# EAGLE design BackPanelBoard (EAGLE 8.3.1)
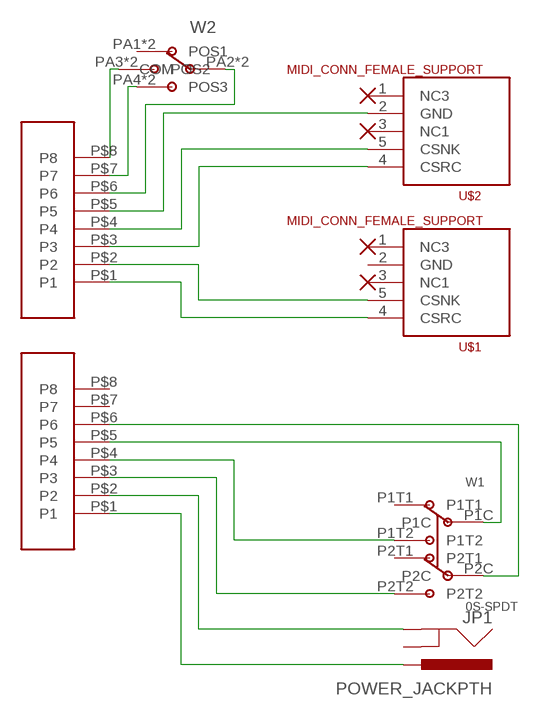
[diagram p0: schematic, sheet 1]

## Parts
JP1  POWER_JACKPTH  [POWER_JACK_PTH]
U$1  MIDI_CONN_FEMALE_SUPPORT  [DIN_5_FEMALE_SUPPORT]
U$2  MIDI_CONN_FEMALE_SUPPORT  [DIN_5_FEMALE_SUPPORT]
U$3  JST_PH8THROUGH_HOLE  [JST_PH8]
U$4  JST_PH8THROUGH_HOLE  [JST_PH8]
W1  0S-SPDT  [0S-SPDT]
W2  0S-SP3T  [0S-SP3T]

## Nets
N$1: U$1.4(CSRC) U$3.P$1(P1)
N$2: U$1.5(CSNK) U$3.P$2(P2)
N$3: U$2.4(CSRC) U$3.P$3(P3)
N$4: U$2.5(CSNK) U$3.P$4(P4)
N$5: U$2.2(GND) U$3.P$5(P5)
N$6: JP1.PWR U$4.P$1(P1)
N$7: JP1.GND U$4.P$2(P2)
N$8: U$4.P$3(P3) W1.P2T2
N$9: U$4.P$4(P4) W1.P1T2
N$10: U$4.P$5(P5) W1.P1C
N$11: U$4.P$6(P6) W1.P2C
N$12: U$3.P$6(P6) W2.PA2(COM) W2.PA6(COM)
N$13: U$3.P$7(P7) W2.PA4(POS3) W2.PA8(POS3)
N$14: U$3.P$8(P8) W2.PA3(POS2) W2.PA7(POS2)
Unconnected: JP1.GNDBREAK U$1.1(NC3) U$1.2(GND) U$1.3(NC1) U$2.1(NC3) U$2.3(NC1) U$4.P$7(P7) U$4.P$8(P8) W1.P1T1 W1.P2T1 W2.PA1(POS1) W2.PA5(POS1)

## Library data of the parts
JP1 = JunoCTRL 1.3:POWER_JACK: Power Jack This is the standard 5.5mm barrel jack for power. The PTH is the most common, proven, reliable, footprint. The Slot footprint only works if the mill layer is transmitted to the PCB fab house so be warned. Mating wall wart : TOL-00298 (and others); PROD_ID: CONN-08197
U$1 U$2 = JunoCTRL 1.3:MIDI_CONN_FEMALE_SUPPORT: MIDI connector with strain relief (DIN-5 female)
U$3 U$4 = JSTCustom:JST_PH8
W1 = JunoCTRL 1.3:0S-SPDT: E-Switch EG 2208A DPDT Switch
W2 = JunoCTRL 1.3:0S-SP3T: E-Switch EG2310 DP3T

## Board
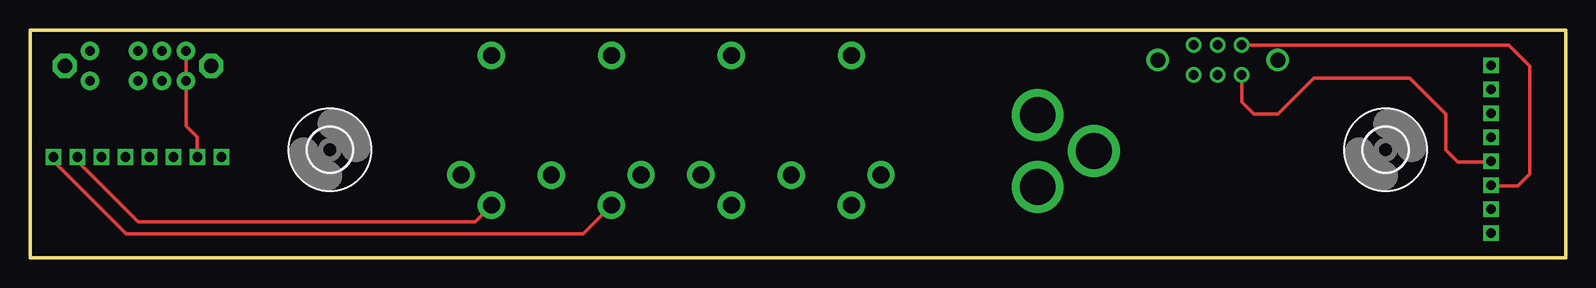
[diagram p1: board, top side]
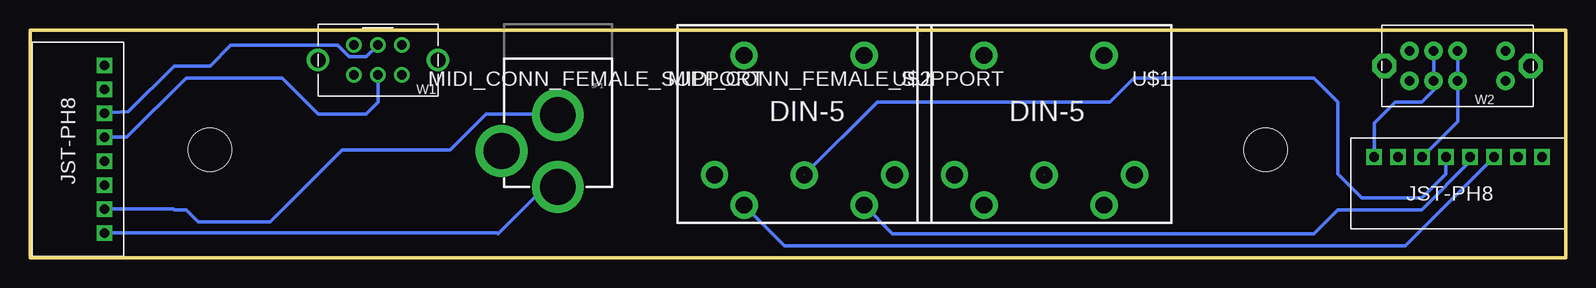
[diagram p2: board, bottom side, seen from below]

Size 128 x 19 mm. Coordinates in mm from the lower left corner, seen from the top.
Outline: 0,0 128,0 128,19 0,19 0,0
Copper layers (1*16): Top 0.035mm / dielectric 1.5mm / Bottom 0.035mm
Design rules "dirt_cheap_dirty_boards.v1.1": minimum track width 6mil, minimum drill 12mil, track to track 6mil, track to pad 6mil, pad to pad 6mil, via to via 6mil, smd to smd 0mil, copper to edge 10mil, drill to drill 10mil, minimum pad ring 10mil, minimum via ring 6mil, stop-mask expansion 2mil, vias tented up to drill 25mil, thermal gap 10mil

### Footprints (pad centres in the part's own frame; a part is rotated, then mirrored left to right if it is on the bottom)
POWER_JACK_PTH = drill 2.997 pad 4.318: GND 0,7.7; GNDBREAK 4.7,10.7; PWR 0,13.7
DIN_5_FEMALE_SUPPORT = drill 1.4 pad 2.286: 1 7.94,3.6; 2 0.46,3.61; 3 -7.07,3.6; 4 5.47,6.13; 5 -4.53,6.12; 6 -4.53,-6.382; 7 5.478,-6.382
JST_PH8 = drill 0.8 square: P$1 1.95,1.6; P$2 3.95,1.6; P$3 5.95,1.6; P$4 7.95,1.6; P$5 9.95,1.6; P$6 11.95,1.6; P$7 13.95,1.6; P$8 15.95,1.6
3,6 = hole 3.6: 0,0
0S-SPDT = drill 1.25: LEFT -5,0; RIGHT 5,0 | drill 0.8: P1C 0,1.25; P1T1 -2,1.25; P1T2 2,1.25; P2C 0,-1.25; P2T1 -2,-1.25; P2T2 2,-1.25
0S-SP3T = drill 1.2 pad 2.032 octagon: LEFT -6.1,0; RIGHT 6.1,0 | drill 0.8 pad 1.524: PA1 -4,-1.25; PA2 0,-1.25; PA3 2,-1.25; PA4 4,-1.25; PA5 -4,1.25; PA6 0,1.25; PA7 2,1.25; PA8 4,1.25

### Placement (x,y rotation side)
JP1  84,19.6 180 bottom
U$1  43,10.5 180 bottom
U$2  63,10.5 180 bottom
U$3  0,10 180 bottom
U$4  120.2,0.1 90 bottom
U$7  [3,6]  25,9 0 top
U$8  [3,6]  113,9 0 top
W1  99,16.5 180 bottom
W2  9,16 180 bottom

### Tracks (layer width: path | path; a pad name or v marks a point on that pad's centre or on a via)
N$1
  Top 0.305: U$3.P$1 1.95,8.05 8,2 46.1,2 U$1.4
N$2
  Top 0.305: U$3.P$2 3.95,8.05 9,3 37.09,3 U$1.5
N$3
  Bottom 0.305: U$2.4 65.1,1 13.35,1 U$3.P$3
N$4
  Bottom 0.305: U$3.P$4 7.95,8.05 12,4 19,4 21,2 56.09,2 U$2.5
N$5
  Bottom 0.305: U$2.2 57.35,13 38,13 36,15 21,15 19,13 19,7 17,5 12,5 10,7 10,8.35 U$3.P$5
N$6
  Bottom 0.305: U$4.P$1 89.05,2.05 89,2 85,6 84.1,6 JP1.PWR
N$7
  Bottom 0.305: U$4.P$2 116.05,4.05 116,4 115,4 114,3 108,3 102,9 93,9 90,12 84.1,12 JP1.GND
N$8
  Top 0.305: W1.P2T2 123.25,17.75 125,16 125,7 124,6 121.85,6 U$4.P$3
N$9
  Top 0.305: W1.P1T2 101,13 102,12 104,12 107,15 115,15 118,12 118,9 119,8 121.75,8 U$4.P$4
N$10
  Bottom 0.305: U$4.P$5 119.95,10.05 115,15 107,15 104,12 100,12 99,13 W1.P1C
N$11
  Bottom 0.305: W1.P2C 99.96,16.79 101.4,16.79 102.35,17.74 104.52,17.74 111.26,17.74 113,16 116,16 119.8,12.2 U$4.P$6
N$12
  Bottom 0.305: W2.PA2 W2.PA6 9,11.35 U$3.P$6
N$13
  Top 0.305: U$3.P$7 13.95,10.05 13,11 W2.PA8 W2.PA4
N$14
  Bottom 0.305: U$3.P$8 15.95,11.25 15.7,11.5 14.2,13 12,13 11,14 W2.PA7 W2.PA3